# Altium schematic sheet PenguinCrust.SchDoc
size A3; PageSetup: Record=PageOptions|CenterHorizontal=True|CenterVertical=True|PrintScale=1.01|XCorrection=1.00|YCorrection=1.00|PrintKind=1|BorderSize=5000000|LeftOffset=0|BottomOffset=0|Orientation=2|PaperLength=1000|PaperWidth=1000|Scale=100|PaperSource=7|PrintQuality=600|MediaType=1|DitherType=10|PrintScaleMode=1|PaperKind=A3 (297 x 420mm)|PaperIndex=8
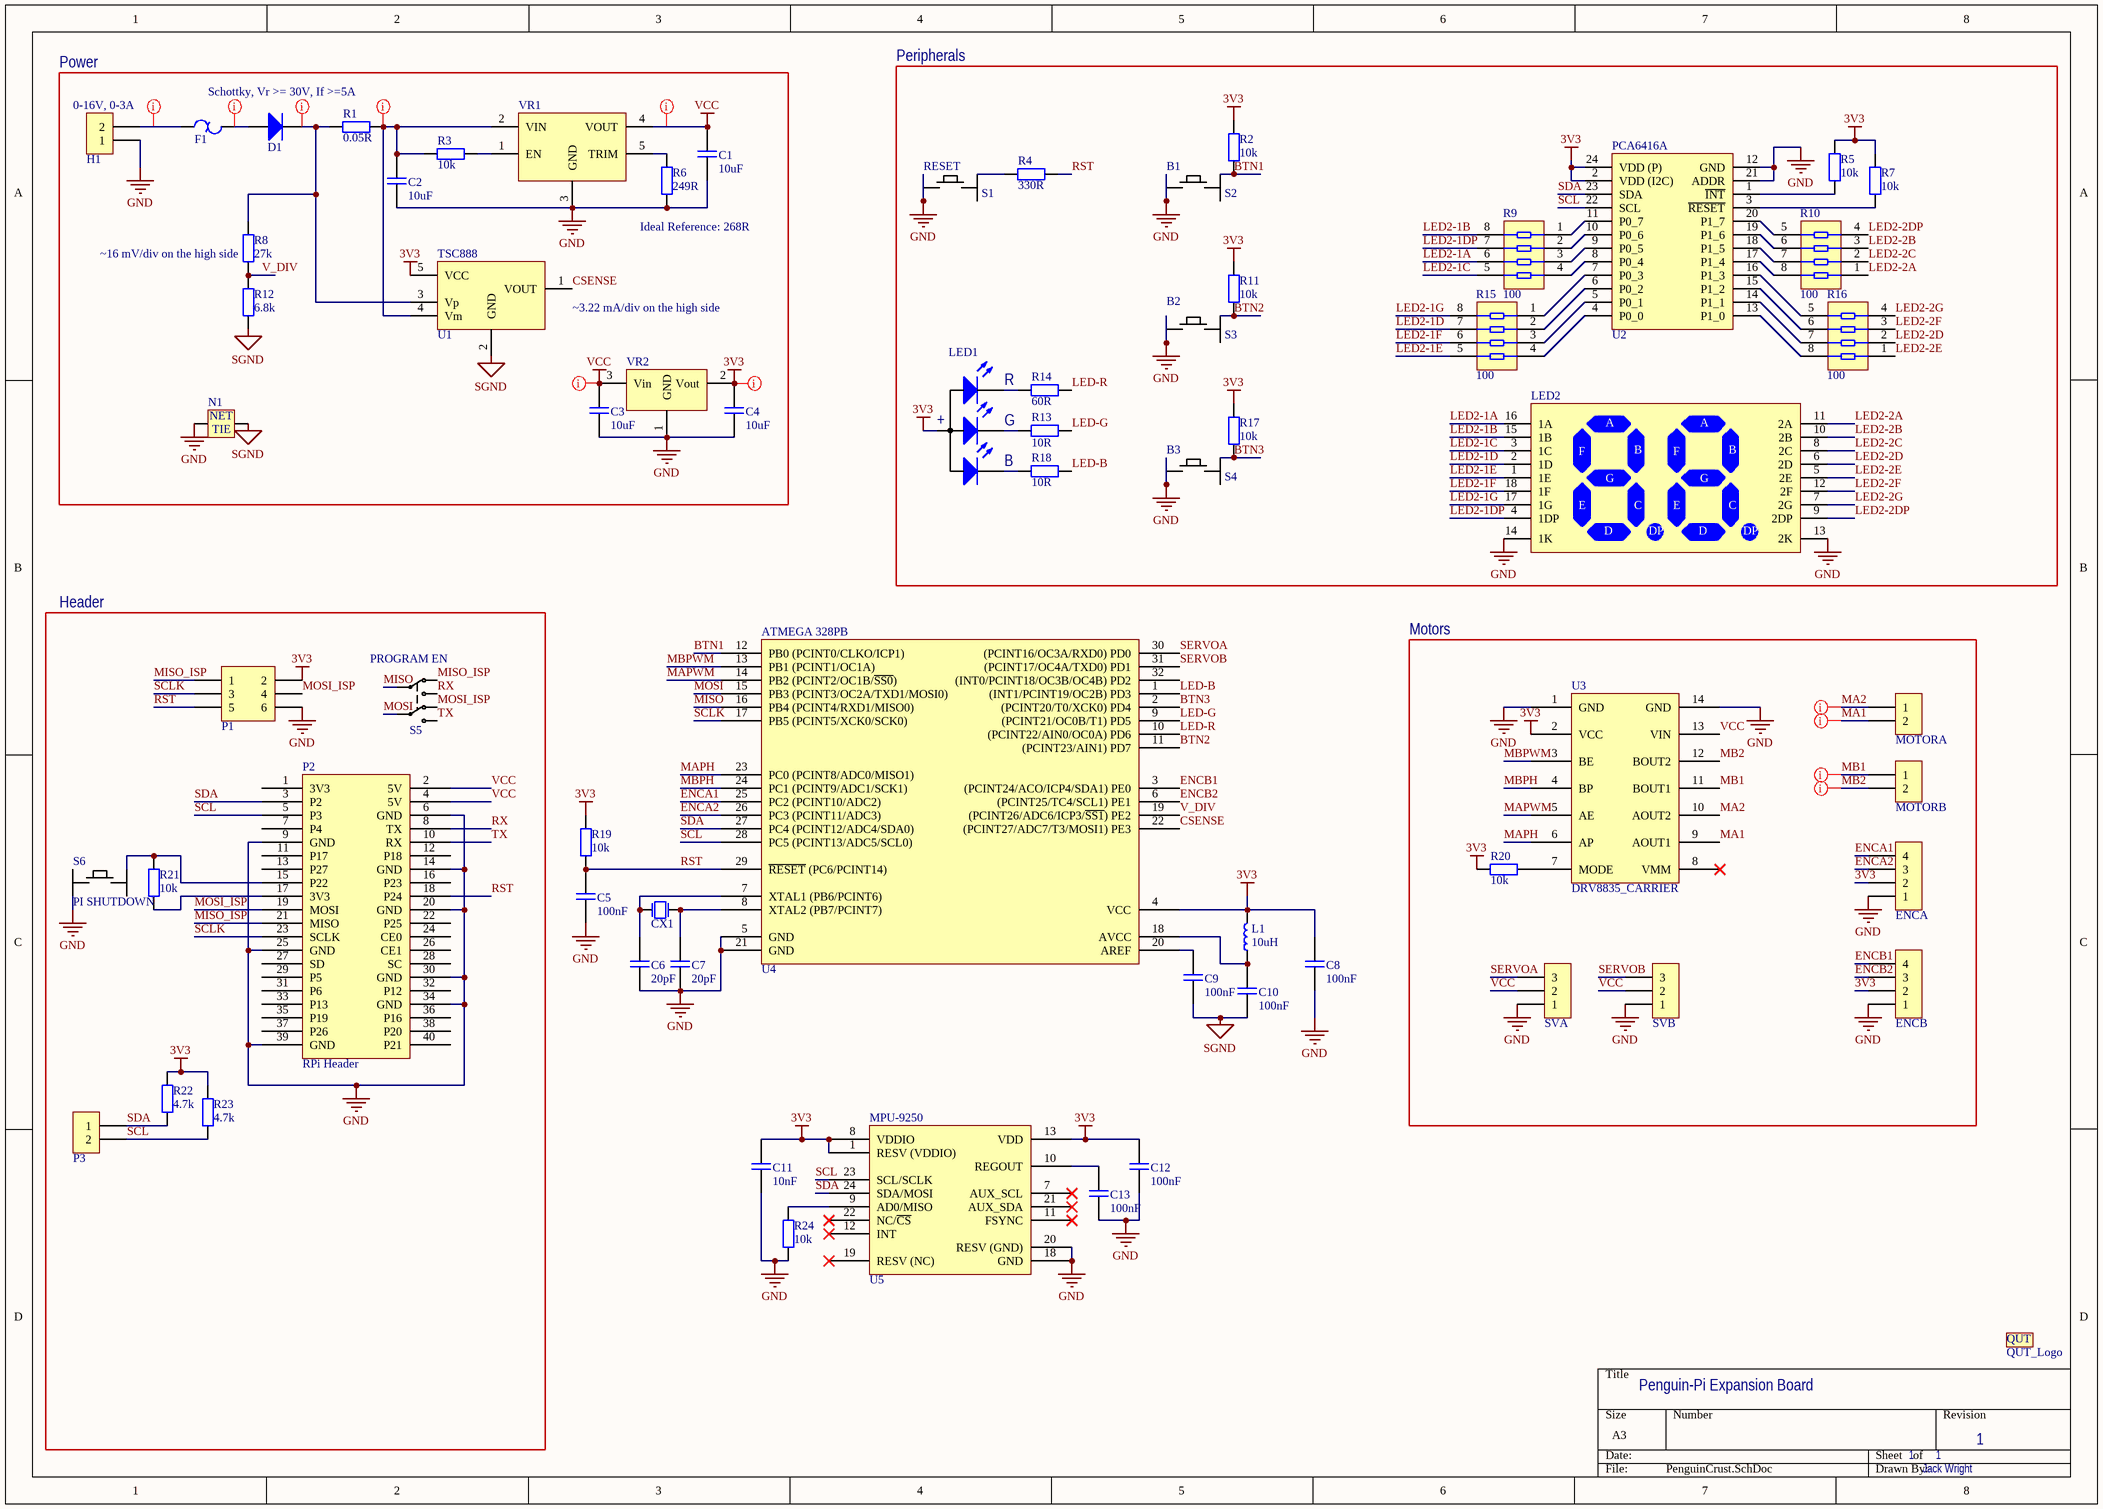
[diagram p0: PenguinCrust.SchDoc]

## Parts
C1  value 10uF  [CAPC2012X07N]  (hidden comment: CAP SMD)
C2  value 10uF  [CAPC2012X07N]  (hidden comment: CAP SMD)
C3  value 10uF  [CAPC2012X07N]  (hidden comment: CAP SMD)
C4  value 10uF  [CAPC2012X07N]  (hidden comment: CAP SMD)
C5  value 100nF  [CAPC2012X07N]  (hidden comment: CAP SMD)
C6  value 20pF  [CAPC2012X07N]  (hidden comment: CAP SMD)
C7  value 20pF  [CAPC2012X07N]  (hidden comment: CAP SMD)
C8  value 100nF  [CAPC2012X07N]  (hidden comment: CAP SMD)
C9  value 100nF  [CAPC2012X07N]  (hidden comment: CAP SMD)
C10  value 100nF  [CAPC2012X07N]  (hidden comment: CAP SMD)
C11  value 10nF  [CAPC2012X07N]  (hidden comment: CAP SMD)
C12  value 100nF  [CAPC2012X07N]  (hidden comment: CAP SMD)
C13  value 100nF  [CAPC2012X07N]  (hidden comment: CAP SMD)
CX1  ABM3B  [ABM3B_CRYSTAL]  (value not drawn)
D1  SMD DIODE  [SODFL470X110-2N]  (value not drawn)
ENCA  JST-4  [B04B-PASK-1]  (value not drawn)
ENCB  JST-4  [B04B-PASK-1]  (value not drawn)
F1  RGEF250  [PPTC-R14]  (value not drawn)
H1  JST-2  [B02B-PASK-1]  (value not drawn)
L1  value 10uH  [CM322522]  (hidden comment: INDUCTOR SMD)
LED1  RGB SMD  [RGB SMD]  (value not drawn)
LED2  7 SEGMENT LED  [HDSP-523n]  (value not drawn)
LG1  QUT_Logo  [QUT_Logo]  (no BOM)
MOTORA  JST-2  [B02B-PASK-1]  (value not drawn)
MOTORB  JST-2  [B02B-PASK-1]  (value not drawn)
N1  NETTIE  [NETTIE-SMD-5mil]  (value not drawn)  (net tie, no BOM)
P1  Header 3x2  [Header 3x2 nonstandard]  (value not drawn)
P2  RPi Header  [RPI 2 Header]
P3  I2C  [Header 2]  (value not drawn)
R1  value 0.05R  [RESC3216X06M]  (hidden comment: RES SMD)
R2  value 10k  [RESC2012X07N]  (hidden comment: RES SMD)
R3  value 10k  [RESC2012X07N]  (hidden comment: RES SMD)
R4  value 330R  [RESC2012X07N]  (hidden comment: RES SMD)
R5  value 10k  [RESC2012X07N]  (hidden comment: RES SMD)
R6  value 249R  [RESC2012X07N]  (hidden comment: RES SMD)
R7  value 10k  [RESC2012X07N]  (hidden comment: RES SMD)
R8  value 27k  [RESC2012X07N]  (hidden comment: RES SMD)
R9  value 100  [CAC-80P319X155-8M]  (hidden comment: ARRAY)
R10  value 100  [CAC-80P319X155-8M]  (hidden comment: ARRAY)
R11  value 10k  [RESC2012X07N]  (hidden comment: RES SMD)
R12  value 6.8k  [RESC2012X07N]  (hidden comment: RES SMD)
R13  value 10R  [RESC2012X07N]  (hidden comment: RES SMD)
R14  value 60R  [RESC2012X07N]  (hidden comment: RES SMD)
R15  value 100  [CAC-80P319X155-8M]  (hidden comment: ARRAY)
R16  value 100  [CAC-80P319X155-8M]  (hidden comment: ARRAY)
R17  value 10k  [RESC2012X07N]  (hidden comment: RES SMD)
R18  value 10R  [RESC2012X07N]  (hidden comment: RES SMD)
R19  value 10k  [RESC2012X07N]  (hidden comment: RES SMD)
R20  value 10k  [RESC2012X07N]  (hidden comment: RES SMD)
R21  value 10k  [RESC2012X07N]  (hidden comment: RES SMD)
R22  value 4.7k  [RESC2012X07N]  (hidden comment: RES SMD)
R23  value 4.7k  [RESC2012X07N]  (hidden comment: RES SMD)
R24  value 10k  [RESC2012X07N]  (hidden comment: RES SMD)
S1  RESET  [E-SWITCH-TL3342]
S2  B1  [E-SWITCH-TL3342]
S3  B2  [E-SWITCH-TL3342]
S4  B3  [E-SWITCH-TL3342]
S5  PROGRAM EN  [JS202011SCQN_DPDT-SMD-SLIDE]
S6  PI SHUTDOWN  [E-SWITCH-TL3342]
SVA  Header 3  [Header 3]  (value not drawn)
SVB  Header 3  [Header 3]  (value not drawn)
U1  TSC888  [SOT95P280X145-5N]
U2  PCA6416A  [TSOP65P640X110-24N]
U3  DRV8835_CARRIER  [DRV8835_CARRIER]
U4  ATMEGA 328PB  [TQFP80P900X900X120-32N]
U5  MPU-9250  [QFN40P300X300X105_HS-25N]
VR1  MURATA_OKR-T3-W12C  [MURATA_OKR-Tn]  (value not drawn)
VR2  3V3 LDO  [SOT230P700X180-4N]  (value not drawn)

## Blocks framed on the sheet
Peripherals: LED1 LED2 R2 R4 R5 R7 R9-R11 R13-R18 S1-S4 U2
Power: C1-C4 D1 F1 H1 N1 R1 R3 R6 R8 R12 U1 VR1 VR2
Header: P1-P3 R21-R23 S5 S6
Motors: ENCA ENCB MOTORA MOTORB R20 SVA SVB U3

## Nets
3V3: C4.2(K) C8.2(K) C11.2(K) C12.2(K) ENCA.2 ENCB.2 L1.2(Cathode) LED1.4(A) P1.2 R2.2 R5.2 R7.2 R11.2 R17.2 R19.2 R20.1 R22.2 R23.2 U1.5(VCC) U2.2(VDD_(I2C)) U2.24(VDD_(P)) U3.2(VCC) U4.4(VCC) U5.1(RESV_(VDDIO)) U5.8(VDDIO) U5.13(VDD) VR2.2(Vout)
GND: C1.1(A) C2.1(A) C3.1(A) C4.1(A) C5.1(A) C6.1(A) C7.1(A) C8.1(A) C11.1(A) C12.1(A) C13.1(A) CX1.2 CX1.4 ENCA.1 ENCB.1 H1.1 LED2.13(2K) LED2.14(1K) N1.1 P1.6 P2.6(GND) P2.9(GND) P2.14(GND) P2.20(GND) P2.25(GND) P2.30(GND) P2.34(GND) P2.39(GND) R6.1 R24.1 S1.1(A) S1.2(A') S2.1(A) S2.2(A') S3.1(A) S3.2(A') S4.1(A) S4.2(A') S6.3(B') SVA.1 SVB.1 U2.12(GND) U2.21(ADDR) U3.1(GND) U3.14(GND) U4.5(GND) U4.21(GND) U5.18(GND) U5.20(RESV_(GND)) VR1.3(GND) VR2.1(GND)
SGND: C9.1(A) C10.1(A) N1.2 R12.1 U1.2(GND)
VCC: C1.2(K) C3.2(K) P2.2(5V) P2.4(5V) SVA.2 SVB.2 U3.13(VIN) VR1.4(VOUT) VR2.3(Vin)
BTN1: R2.1 S2.4(B) U4.12(PB0_(PCINT0/CLKO/ICP1))
BTN2: R11.1 S3.4(B) U4.11((PCINT23/AIN1)_PD7)
BTN3: R17.1 S4.4(B) U4.2((PCINT20/T0/XCK0)_PD4)
CSENSE: U1.1(VOUT) U4.22((PCINT27/ADC7/T3/MOSI1)_PE3)
ENCA1: ENCA.4 U4.25(PC2_(PCINT10/ADC2))
ENCA2: ENCA.3 U4.26(PC3_(PCINT11/ADC3))
ENCB1: ENCB.4 U4.3((PCINT24/ACO/ICP4/SDA1)_PE0)
ENCB2: ENCB.3 U4.6((PCINT25/TC4/SCL1)_PE1)
LED2-1A: LED2.16(1A) R9.6
LED2-1B: LED2.15(1B) R9.8
LED2-1C: LED2.3(1C) R9.5
LED2-1D: LED2.2(1D) R15.7
LED2-1DP: LED2.4(1DP) R9.7
LED2-1E: LED2.1(1E) R15.5
LED2-1F: LED2.18(1F) R15.6
LED2-1G: LED2.17(1G) R15.8
LED2-2A: LED2.11(2A) R10.1
LED2-2B: LED2.10(2B) R10.3
LED2-2C: LED2.8(2C) R10.2
LED2-2D: LED2.6(2D) R16.2
LED2-2DP: LED2.9(2DP) R10.4
LED2-2E: LED2.5(2E) R16.1
LED2-2F: LED2.12(2F) R16.3
LED2-2G: LED2.7(2G) R16.4
LED-B: R18.2 U4.1((INT1/PCINT19/OC2B)_PD3)
LED-G: R13.2 U4.9((PCINT21/OC0B/T1)_PD5)
LED-R: R14.2 U4.10((PCINT22/AIN0/OC0A)_PD6)
MA1: MOTORA.2 U3.9(AOUT1)
MA2: MOTORA.1 U3.10(AOUT2)
MAPH: U3.6(AP) U4.23(PC0_(PCINT8/ADC0/MISO1))
MAPWM: U3.5(AE) U4.14(PB2_(PCINT2/OC1B/~{SS0}))
MB1: MOTORB.1 U3.11(BOUT1)
MB2: MOTORB.2 U3.12(BOUT2)
MBPH: U3.4(BP) U4.24(PC1_(PCINT9/ADC1/SCK1))
MBPWM: U3.3(BE) U4.13(PB1_(PCINT1/OC1A))
MISO: S5.2 U4.16(PB4_(PCINT4/RXD1/MISO0))
MISO_ISP: P1.1 P2.21(MISO) S5.1
MOSI: S5.5 U4.15(PB3_(PCINT3/OC2A/TXD1/MOSI0))
MOSI_ISP: P1.4 P2.19(MOSI) S5.4
RST: C5.2(K) P1.5 P2.18(P24) R4.2 R19.1 U4.29(~{RESET}_(PC6/PCINT14))
RX: P2.8(TX) S5.3
SCL: P2.5(P3) P3.2 R23.1 U2.22(SCL) U4.28(PC5_(PCINT13/ADC5/SCL0)) U5.23(SCL/SCLK)
SCLK: P1.3 P2.23(SCLK) U4.17(PB5_(PCINT5/XCK0/SCK0))
SDA: P2.3(P2) P3.1 R22.1 U2.23(SDA) U4.27(PC4_(PCINT12/ADC4/SDA0)) U5.24(SDA/MOSI)
SERVOA: SVA.3 U4.30((PCINT16/OC3A/RXD0)_PD0)
SERVOB: SVB.3 U4.31((PCINT17/OC4A/TXD0)_PD1)
TX: P2.10(RX) S5.6
V_DIV: R8.1 R12.2 U4.19((PCINT26/ADC6/ICP3/~{SS1})_PE2)
NetC2_2: C2.2(K) R1.2 R3.2 U1.4(Vm) VR1.2(VIN)
NetC6_2: C6.2(K) CX1.1 U4.7(XTAL1_(PB6/PCINT6))
NetC7_2: C7.2(K) CX1.3 U4.8(XTAL2_(PB7/PCINT7))
NetC9_2: C9.2(K) U4.20(AREF)
NetC10_2: C10.2(K) L1.1(Anode) U4.18(AVCC)
NetC13_2: C13.2(K) U5.10(REGOUT)
NetD1_1: D1.1 F1.2
NetD1_2: D1.2 R1.1 R8.2 U1.3(Vp)
NetF1_1: F1.1 H1.2
NetLED1_1: LED1.1(K-R) R14.1
NetLED1_2: LED1.2(K-G) R13.1
NetLED1_3: LED1.3(K-B) R18.1
NetP2_15: P2.15(P22) R21.1 S6.1(A)
NetP2_17: P2.17(3V3) R21.2
NetR3_1: R3.1 VR1.1(EN)
NetR4_1: R4.1 S1.4(B)
NetR5_1: R5.1 U2.1(~{INT})
NetR6_2: R6.2 VR1.5(TRIM)
NetR7_1: R7.1 U2.3(~{RESET})
NetR9_1: R9.1 U2.11(P0_7)
NetR9_2: R9.2 U2.10(P0_6)
NetR9_3: R9.3 U2.9(P0_5)
NetR9_4: R9.4 U2.8(P0_4)
NetR10_5: R10.5 U2.20(P1_7)
NetR10_6: R10.6 U2.19(P1_6)
NetR10_7: R10.7 U2.18(P1_5)
NetR10_8: R10.8 U2.17(P1_4)
NetR15_1: R15.1 U2.7(P0_3)
NetR15_2: R15.2 U2.6(P0_2)
NetR15_3: R15.3 U2.5(P0_1)
NetR15_4: R15.4 U2.4(P0_0)
NetR16_5: R16.5 U2.16(P1_3)
NetR16_6: R16.6 U2.15(P1_2)
NetR16_7: R16.7 U2.14(P1_1)
NetR16_8: R16.8 U2.13(P1_0)
NetR20_2: R20.2 U3.7(MODE)
NetR24_2: R24.2 U5.9(AD0/MISO)

Not connected (* = marked no-connect by the designer): P2 1(3V3) 7(P4) 11(P17) 12(P18) 13(P27) 16(P23) 22(P25) 24(CE0) 26(CE1) 27(SD) 28(SC) 29(P5) 31(P6) 32(P12) 33(P13) 35(P19) 36(P16) 37(P26) 38(P20) 40(P21); S1 3(B'); S2 3(B'); S3 3(B'); S4 3(B'); S6 2(A') 4(B); U3 8(VMM)*; U4 32((INT0/PCINT18/OC3B/OC4B)_PD2); U5 2(NC) 3(NC) 4(NC) 5(NC) 6(NC) 7(AUX_SCL)* 11(FSYNC)* 12(INT)* 14(NC) 15(NC) 16(NC) 17(NC) 19(RESV_(NC))* 21(AUX_SDA)* 22(NC/~{CS})*

## Layout directives
net class Power: 3V3, MA1, MA2, MB1, MB2, NetC2_2, NetD1_1, NetD1_2, NetF1_1, VCC

## Notes on the sheet
- (near H1) 0-16V, 0-3A
- Schottky, Vr >= 30V, If >=5A
- Ideal Reference: 268R
- (near R8) ~16 mV/div on the high side
- (near U1) ~3.22 mA/div on the high side
- Penguin-Pi Expansion Board
- 1
- Jack Wright
- (in symbol HDSP-523n) A; F; B; G; E; C; D; DP
- (in symbol NETTIE) NET; TIE
- (in symbol QUT_Logo) QUT
- (in symbol RGB SMD) R; +; G; B

## Library data of the parts
C1-C13 = CAP SMD: Surface mount capacitor
CX1 = ABM3B_CRYSTAL: Surface Mount Crystal Oscillator; Value: 12MHz
D1 = SMD DIODE: Surface mount Diode
ENCA ENCB = B04B-PASK-1: 4 pin Top Entry JST header
F1 = RGEF250: PPTC Thermal Fuse; Hold Current: 2.5A; Trip Current: 4.7A; VRating: 16V
H1 MOTORA MOTORB = B02B-PASK-1: 2 pin Top Entry JST header
L1 = INDUCTOR SMD: Surface Mount Inductor - varying sizes
LED1 = RGB SMD: ASMB-MTB1-0A3A2
LED2 = HDSP-523n: Double digit 7 segment LED-through hole
P1 = Header 3x2 Staggered: 3 by 2 header, staggered pin arrangement
P2 = RPi 2 Header: GPIO connector for Raspberry Pi Microcomputer
P3 = Header 2: 2 pin header
R1-R8 R11-R14 R17-R24 = RES SMD: 0805 surface mount resistor
R9 R10 R15 R16 = RES-ARRAY: Surface mount resistor array
S1-S4 S6 = E-SWITCH-PUSHBUTTON: TL 3342 surface mount pushbutton
S5 = JS202011SCQN_DPDT-SMD-SLIDE: DPDT Slide switch
SVA SVB = Header 3: 3 pin header
U1 = TSC888: Curent Sense Amplifier
U2 = PCA6416APW: Low-voltage translating 16-bit I2C I/O port expander
U3 = DRV8835_CARRIER: DRV8835 Motor Controller
U4 = ATMEGA 328PB: 32 pin Microcontroller
U5 = MPU-9250: 6 axis IMU
VR1 = MURATA_OKR-T3-W12C: 5V 3A switching voltage regulator
VR2 = 3V3 LDO: 3.3 V Low Dropout Regulator; Part Number: *